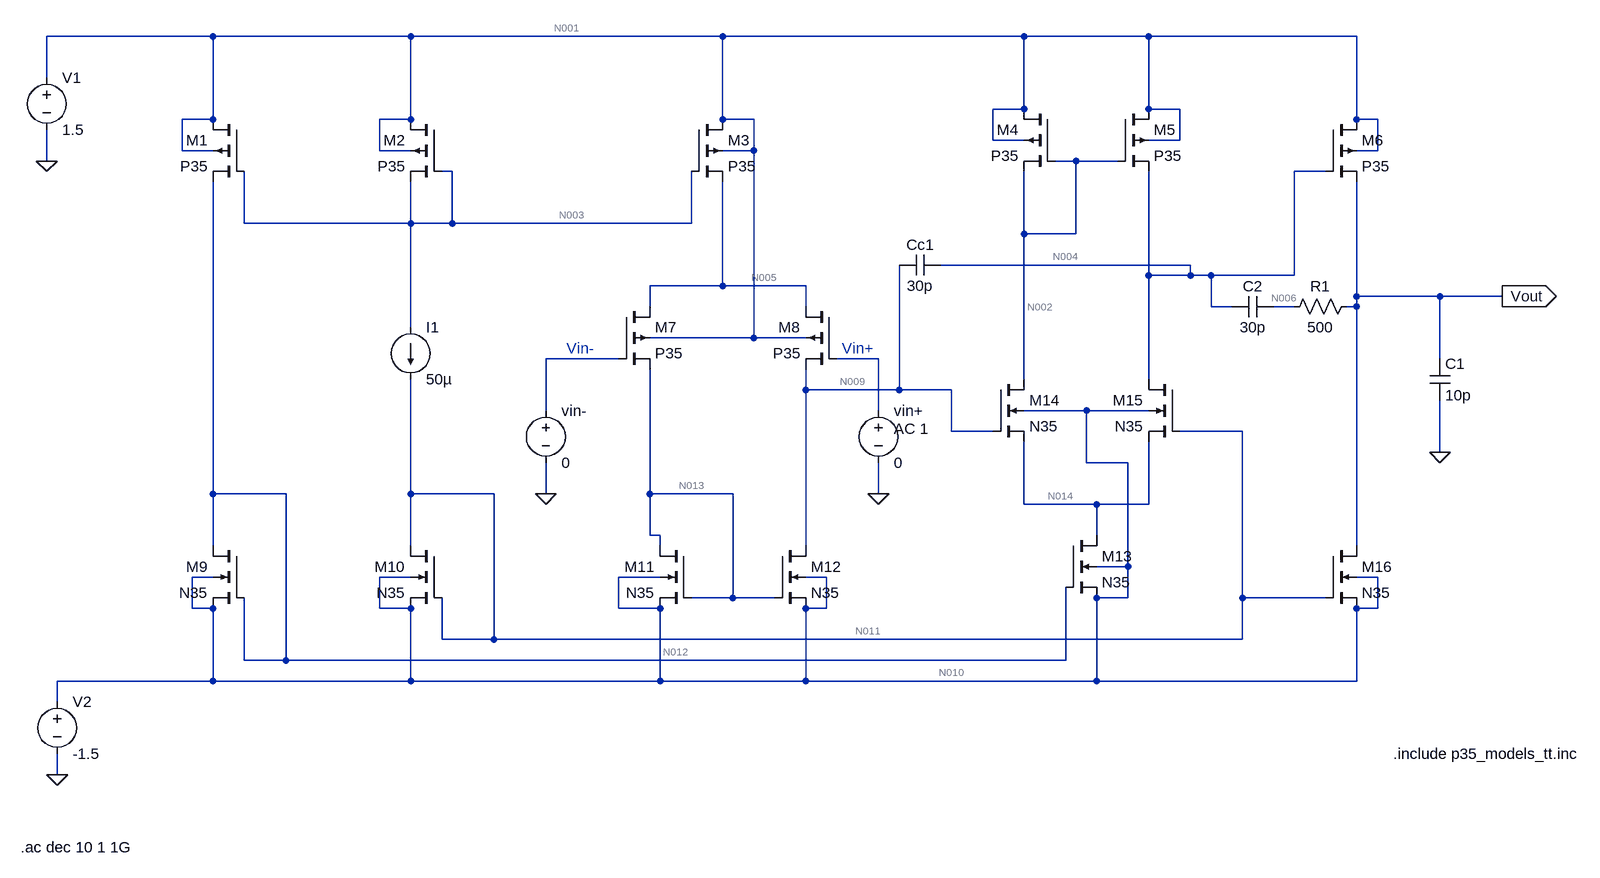
[diagram p0: schematic Draft3.asc]
Draft3.asc, the LTspice schematic file:
Version 4.1
SHEET 1 1724 680
WIRE -432 -880 -688 -880
WIRE -128 -880 -432 -880
WIRE 352 -880 -128 -880
WIRE 816 -880 352 -880
WIRE 1008 -880 816 -880
WIRE 1328 -880 1008 -880
WIRE -688 -816 -688 -880
WIRE 816 -768 816 -880
WIRE 816 -768 768 -768
WIRE 1008 -768 1008 -880
WIRE 1056 -768 1008 -768
WIRE -432 -752 -432 -880
WIRE -432 -752 -480 -752
WIRE -128 -752 -128 -880
WIRE -128 -752 -176 -752
WIRE 352 -752 352 -880
WIRE 400 -752 352 -752
WIRE 1328 -752 1328 -880
WIRE 1360 -752 1328 -752
WIRE 768 -720 768 -768
WIRE 816 -720 768 -720
WIRE 1056 -720 1056 -768
WIRE 1056 -720 1008 -720
WIRE -480 -704 -480 -752
WIRE -432 -704 -480 -704
WIRE -176 -704 -176 -752
WIRE -128 -704 -176 -704
WIRE 400 -704 400 -752
WIRE 400 -704 352 -704
WIRE 1360 -704 1360 -752
WIRE 1360 -704 1328 -704
WIRE -688 -688 -688 -736
WIRE 896 -688 864 -688
WIRE 960 -688 896 -688
WIRE -64 -672 -80 -672
WIRE 1280 -672 1232 -672
WIRE -384 -592 -384 -672
WIRE -128 -592 -128 -656
WIRE -128 -592 -384 -592
WIRE -64 -592 -64 -672
WIRE -64 -592 -128 -592
WIRE 304 -592 304 -672
WIRE 304 -592 -64 -592
WIRE 816 -576 816 -672
WIRE 896 -576 896 -688
WIRE 896 -576 816 -576
WIRE 1072 -528 688 -528
WIRE 1008 -512 1008 -672
WIRE 1072 -512 1072 -528
WIRE 1072 -512 1008 -512
WIRE 1104 -512 1072 -512
WIRE 1232 -512 1232 -672
WIRE 1232 -512 1104 -512
WIRE 352 -496 352 -656
WIRE 352 -496 240 -496
WIRE 480 -496 352 -496
WIRE 1328 -480 1328 -656
WIRE 1456 -480 1328 -480
WIRE 1552 -480 1456 -480
WIRE 240 -464 240 -496
WIRE 480 -464 480 -496
WIRE 1104 -464 1104 -512
WIRE 1136 -464 1104 -464
WIRE 1232 -464 1200 -464
WIRE 1328 -464 1328 -480
WIRE 1328 -464 1312 -464
WIRE -128 -432 -128 -592
WIRE 400 -416 400 -704
WIRE 400 -416 240 -416
WIRE 480 -416 400 -416
WIRE 192 -384 80 -384
WIRE 592 -384 528 -384
WIRE 1456 -384 1456 -480
WIRE 816 -352 816 -576
WIRE 1008 -352 1008 -512
WIRE 480 -336 480 -368
WIRE 624 -336 624 -528
WIRE 624 -336 480 -336
WIRE 704 -336 624 -336
WIRE 80 -304 80 -384
WIRE 592 -304 592 -384
WIRE 912 -304 816 -304
WIRE 1008 -304 912 -304
WIRE 704 -272 704 -336
WIRE 768 -272 704 -272
WIRE 1152 -272 1056 -272
WIRE 1456 -240 1456 -320
WIRE 912 -224 912 -304
WIRE 976 -224 912 -224
WIRE -432 -176 -432 -656
WIRE -320 -176 -432 -176
WIRE -128 -176 -128 -352
WIRE 0 -176 -128 -176
WIRE 80 -176 80 -224
WIRE 240 -176 240 -368
WIRE 368 -176 240 -176
WIRE 592 -176 592 -224
WIRE 816 -160 816 -256
WIRE 928 -160 816 -160
WIRE 1008 -160 1008 -256
WIRE 1008 -160 928 -160
WIRE 240 -112 240 -176
WIRE 256 -112 240 -112
WIRE 928 -112 928 -160
WIRE -432 -96 -432 -176
WIRE -128 -96 -128 -176
WIRE 256 -96 256 -112
WIRE 480 -96 480 -336
WIRE 1328 -96 1328 -464
WIRE 976 -64 976 -224
WIRE 976 -64 928 -64
WIRE -432 -48 -464 -48
WIRE -128 -48 -176 -48
WIRE 256 -48 192 -48
WIRE 512 -48 480 -48
WIRE 1360 -48 1328 -48
WIRE 368 -16 368 -176
WIRE 368 -16 304 -16
WIRE 432 -16 368 -16
WIRE 976 -16 976 -64
WIRE 976 -16 928 -16
WIRE 1152 -16 1152 -272
WIRE 1280 -16 1152 -16
WIRE -464 0 -464 -48
WIRE -432 0 -464 0
WIRE -176 0 -176 -48
WIRE -128 0 -176 0
WIRE 192 0 192 -48
WIRE 256 0 192 0
WIRE 512 0 512 -48
WIRE 512 0 480 0
WIRE 1328 0 1328 -16
WIRE 1360 0 1360 -48
WIRE 1360 0 1328 0
WIRE -80 48 -80 -16
WIRE 0 48 0 -176
WIRE 0 48 -80 48
WIRE 1152 48 1152 -16
WIRE 1152 48 0 48
WIRE -384 80 -384 -16
WIRE -320 80 -320 -176
WIRE -320 80 -384 80
WIRE 880 80 880 -32
WIRE 880 80 -320 80
WIRE -432 112 -432 0
WIRE -432 112 -672 112
WIRE -128 112 -128 0
WIRE -128 112 -432 112
WIRE 256 112 256 0
WIRE 256 112 -128 112
WIRE 480 112 480 0
WIRE 480 112 256 112
WIRE 928 112 928 -16
WIRE 928 112 480 112
WIRE 1328 112 1328 0
WIRE 1328 112 928 112
WIRE -672 144 -672 112
WIRE -672 256 -672 224
FLAG 1456 -240 0
FLAG 80 -176 0
FLAG 592 -176 0
FLAG -688 -688 0
FLAG -672 256 0
FLAG 1552 -480 Vout
IOPIN 1552 -480 Out
SYMBOL pmos4 -384 -752 M0
SYMATTR InstName M1
SYMATTR Value P35
SYMATTR Value2 l=1.8u w=70u
SYMBOL pmos4 -80 -752 M0
SYMATTR InstName M2
SYMATTR Value P35
SYMATTR Value2 l=1.8u w=70u
SYMBOL pmos4 304 -752 R0
SYMATTR InstName M3
SYMATTR Value P35
SYMATTR Value2 l=1.8u w=140u
SYMBOL pmos4 864 -768 M0
SYMATTR InstName M4
SYMATTR Value P35
SYMATTR Value2 l=0.9u w=27u
SYMBOL pmos4 960 -768 R0
SYMATTR InstName M5
SYMATTR Value P35
SYMATTR Value2 l=0.9u w=27u
SYMBOL pmos4 1280 -752 R0
SYMATTR InstName M6
SYMATTR Value P35
SYMATTR Value2 l=0.9u w=190u
SYMBOL pmos4 192 -464 R0
SYMATTR InstName M7
SYMATTR Value P35
SYMATTR Value2 l=0.3u w=35u
SYMBOL pmos4 528 -464 M0
SYMATTR InstName M8
SYMATTR Value P35
SYMATTR Value2 l=0.3u w=35u
SYMBOL nmos4 -384 -96 M0
SYMATTR InstName M9
SYMATTR Value N35
SYMATTR Value2 l=1.8u w=70u
SYMBOL nmos4 -80 -96 M0
SYMATTR InstName M10
SYMATTR Value N35
SYMATTR Value2 l=0.9u w=8.6u
SYMBOL nmos4 304 -96 M0
SYMATTR InstName M11
SYMATTR Value N35
SYMATTR Value2 l=0.9u w=8.6u
SYMBOL nmos4 432 -96 R0
SYMATTR InstName M12
SYMATTR Value N35
SYMATTR Value2 l=0.9u w=8.6u
SYMBOL nmos4 880 -112 R0
SYMATTR InstName M13
SYMATTR Value N35
SYMATTR Value2 l=1.8u w=123u
SYMBOL nmos4 768 -352 R0
SYMATTR InstName M14
SYMATTR Value N35
SYMATTR Value2 l=0.3u w=10u
SYMBOL nmos4 1056 -352 M0
SYMATTR InstName M15
SYMATTR Value N35
SYMATTR Value2 l=0.3u w=10u
SYMBOL nmos4 1280 -96 R0
SYMATTR InstName M16
SYMATTR Value N35
SYMATTR Value2 l=1.8u w=54u
SYMBOL cap 1440 -384 R0
SYMATTR InstName C1
SYMATTR Value 10p
SYMBOL voltage 80 -320 R0
WINDOW 123 0 0 Left 0
WINDOW 39 0 0 Left 0
SYMATTR InstName vin-
SYMATTR Value 0
SYMBOL voltage 592 -320 R0
WINDOW 123 24 44 Left 2
WINDOW 39 0 0 Left 0
SYMATTR Value2 AC 1
SYMATTR InstName vin+
SYMATTR Value 0
SYMBOL voltage -688 -832 R0
WINDOW 123 0 0 Left 0
WINDOW 39 0 0 Left 0
SYMATTR InstName V1
SYMATTR Value 1.5
SYMBOL voltage -672 128 R0
WINDOW 123 0 0 Left 0
WINDOW 39 0 0 Left 0
SYMATTR InstName V2
SYMATTR Value -1.5
SYMBOL cap 624 -512 R270
WINDOW 0 32 32 VTop 2
WINDOW 3 0 32 VBottom 2
SYMATTR InstName Cc1
SYMATTR Value 30p
SYMBOL cap 1136 -448 R270
WINDOW 0 32 32 VTop 2
WINDOW 3 0 32 VBottom 2
SYMATTR InstName C2
SYMATTR Value 30p
SYMBOL res 1328 -480 R90
WINDOW 0 0 56 VBottom 2
WINDOW 3 32 56 VTop 2
SYMATTR InstName R1
SYMATTR Value 500
SYMBOL current -128 -432 R0
WINDOW 123 0 0 Left 0
WINDOW 39 0 0 Left 0
SYMATTR InstName I1
SYMATTR Value 50µ
TEXT 1384 224 Left 2 !.include p35_models_tt.inc
TEXT 112 -400 Left 2 ;Vin-
TEXT 536 -400 Left 2 ;Vin+
TEXT -728 368 Left 2 !.ac dec 10 1 1G

The netlist it stands for:
* Draft3.asc
M1 N001 N003 N012 N001 P35 l=1.8u w=70u
M2 N001 N003 N003 N001 P35 l=1.8u w=70u
M3 N001 N003 N005 N001 P35 l=1.8u w=140u
M4 N001 N002 N002 N001 P35 l=0.9u w=27u
M5 N001 N002 N004 N001 P35 l=0.9u w=27u
M6 N001 N004 Vout N001 P35 l=0.9u w=190u
M7 N005 N007 N013 N001 P35 l=0.3u w=35u
M8 N005 N008 N009 N001 P35 l=0.3u w=35u
M9 N012 N012 N010 N010 N35 l=1.8u w=70u
M10 N011 N011 N010 N010 N35 l=0.9u w=8.6u
M11 N013 N013 N010 N010 N35 l=0.9u w=8.6u
M12 N009 N013 N010 N010 N35 l=0.9u w=8.6u
M13 N014 N012 N010 N010 N35 l=1.8u w=123u
M14 N002 N009 N014 N010 N35 l=0.3u w=10u
M15 N004 N011 N014 N010 N35 l=0.3u w=10u
M16 Vout N011 N010 N010 N35 l=1.8u w=54u
C1 Vout 0 10p
vin- N007 0 0
vin+ N008 0 0 AC 1
V1 N001 0 1.5
V2 N010 0 -1.5
Cc1 N009 N004 30p
C2 N004 N006 30p
R1 Vout N006 500
I1 N003 N011 50µ
.model NMOS NMOS
.model PMOS PMOS
.lib standard.mos
.include p35_models_tt.inc
* Vin-
* Vin+
.ac dec 10 1 1G
.backanno
.end

* Results of the author's LTspice run, read from the files saved beside the schematic
* Operating Point, zero values left out:
*   V(n001) = 1.5 V
*   V(n002) = 613.3 mV
*   V(n003) = 662.7 mV
*   V(n004) = 666.6 mV
*   V(n005) = 906.7 mV
*   V(n006) = 837.6 mV
*   V(n009) = -665.9 mV
*   V(n010) = -1.5 V
*   V(n011) = -668.1 mV
*   V(n012) = -825.9 mV
*   V(n013) = -665.9 mV
*   V(n014) = -1.355 V
*   V(vout) = 837.6 mV
*   I(I1) = 50 µA
*   I(V1) = -516.5 µA
*   I(V2) = 516.5 µA
*   Ib(M1) = 2.336 pA
*   Ib(M14) = -2.278 pA
*   Ib(M15) = -2.331 pA
*   Ib(M16) = -2.348 pA
*   Ib(M7) = 2.779 pA
*   Ib(M8) = 2.779 pA
*   Id(M1) = 53.65 µA
*   Id(M10) = 50 µA
*   Id(M11) = 50.87 µA
*   Id(M12) = 50.87 µA
*   Id(M13) = 89.75 µA
*   Id(M14) = 45.02 µA
*   Id(M15) = 44.73 µA
*   Id(M16) = 221.4 µA
*   Id(M2) = 50 µA
*   Id(M3) = 101.7 µA
*   Id(M4) = 45.02 µA
*   Id(M5) = 44.73 µA
*   Id(M6) = 221.4 µA
*   Id(M7) = 50.87 µA
*   Id(M8) = 50.87 µA
*   Id(M9) = 53.65 µA
*   Is(M1) = -53.65 µA
*   Is(M10) = -50 µA
*   Is(M11) = -50.87 µA
*   Is(M12) = -50.87 µA
*   Is(M13) = -89.75 µA
*   Is(M14) = -45.02 µA
*   Is(M15) = -44.73 µA
*   Is(M16) = -221.4 µA
*   Is(M2) = -50 µA
*   Is(M3) = -101.7 µA
*   Is(M4) = -45.02 µA
*   Is(M5) = -44.73 µA
*   Is(M6) = -221.4 µA
*   Is(M7) = -50.87 µA
*   Is(M8) = -50.87 µA
*   Is(M9) = -53.65 µA
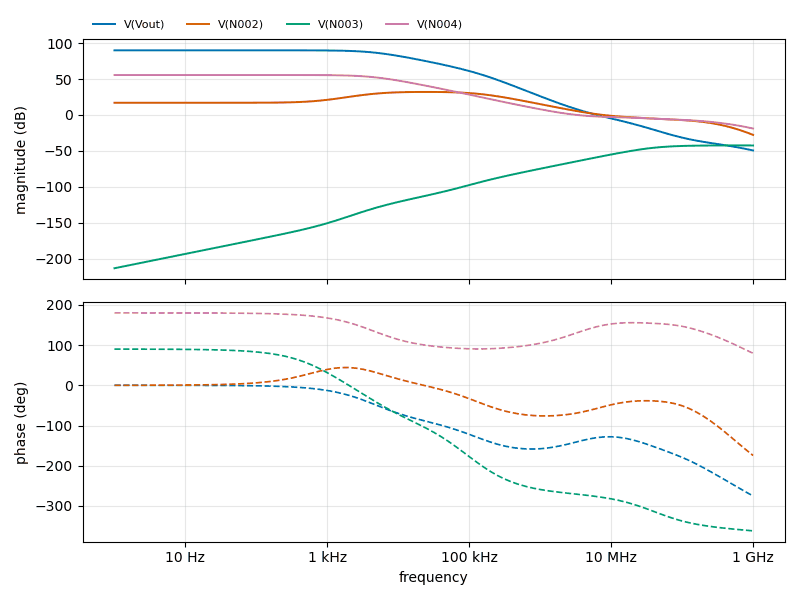
[diagram p1: AC Analysis of Draft3.asc, plotted from the saved traces]
* AC Analysis, 1 run:
*   V(Vout): 90.03 dB at 1 Hz, -49.46 dB at 1 GHz, peak 90.03 dB at 1 Hz, 3 dB below the peak at 4.457 kHz
*   V(N002): 17.03 dB at 1 Hz, -27.70 dB at 1 GHz, peak 32.08 dB at 25.12 kHz, 3 dB below the peak at 4.104 kHz and 145.2 kHz
*   V(N003): -213.51 dB at 1 Hz, -42.51 dB at 1 GHz, peak -42.40 dB at 501.2 MHz, 3 dB below the peak at 42.43 MHz
*   V(N004): 55.66 dB at 1 Hz, -18.85 dB at 1 GHz, peak 55.66 dB at 1 Hz, 3 dB below the peak at 4.461 kHz